# EasyEDA schematic LM471-2-feb-15.json
TITLE: Sheet_1; REV: 1.0; Date: 2024-01-02; Sheet: 1/1; Company: Your Company
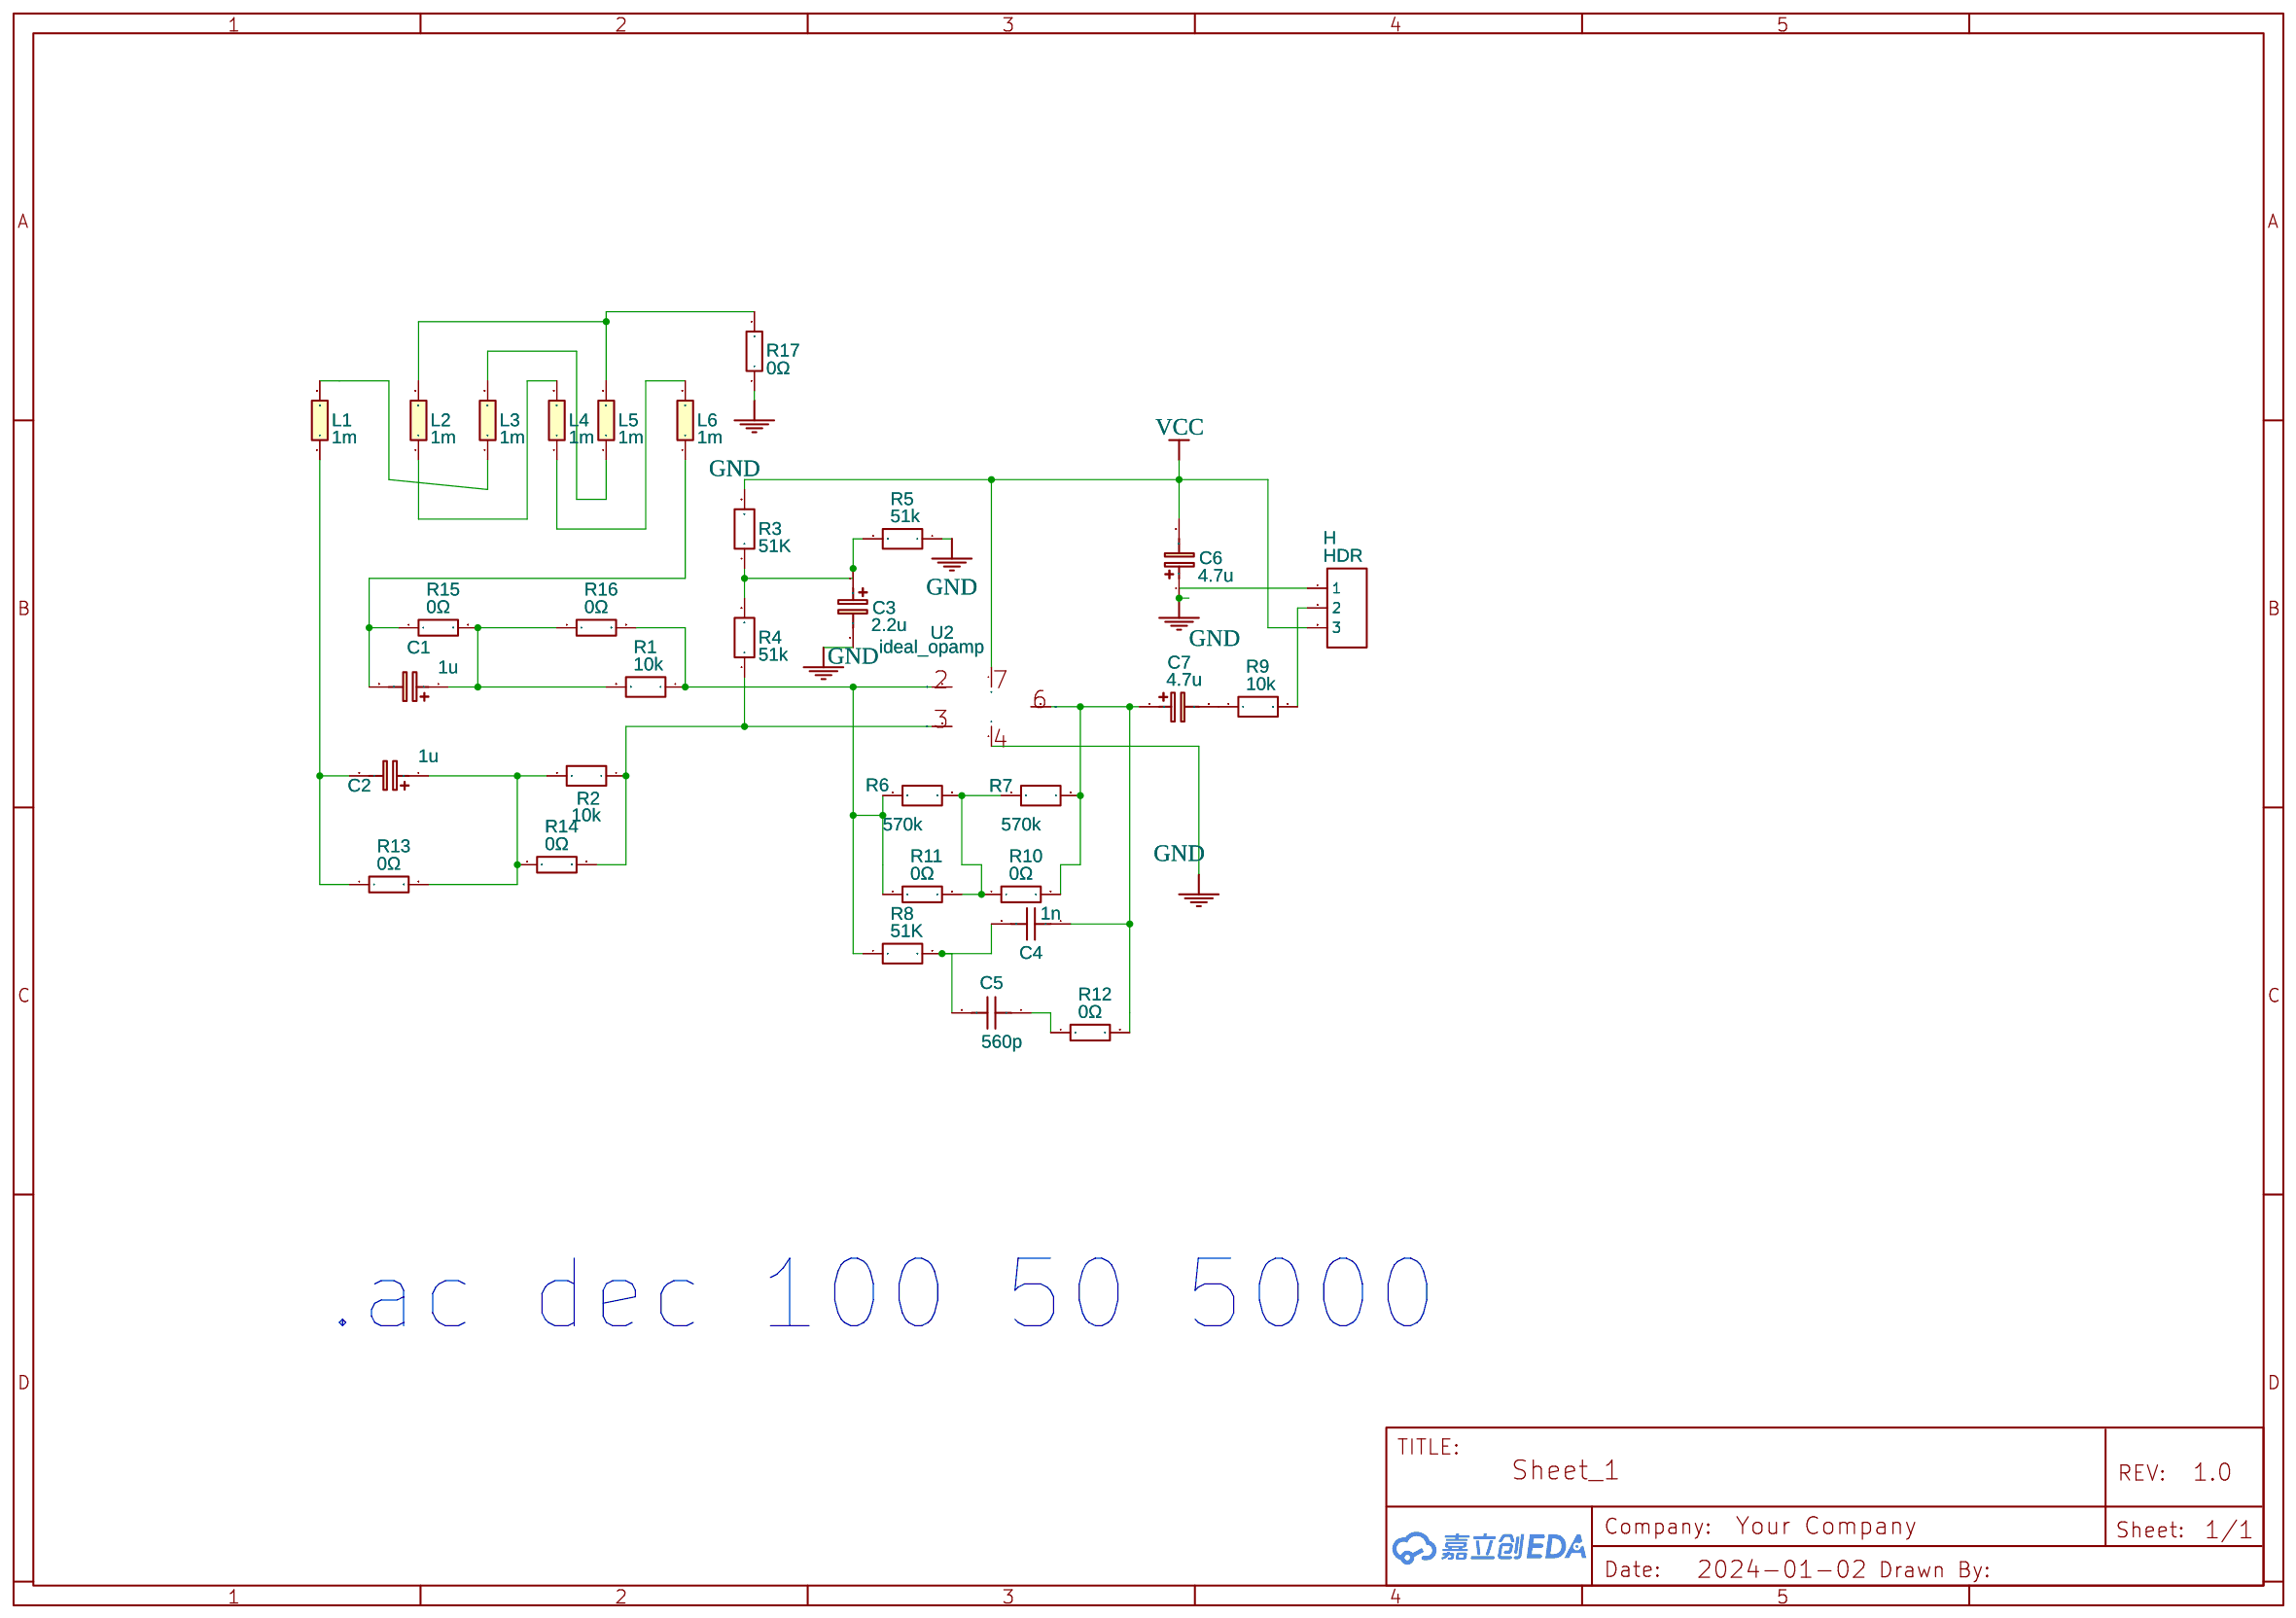
[diagram p0: schematic sheet]

## Parts
C1  1u  [CAPACITOR_SMD0805_HANDSOLDERING_REVA_DATE21JUN2010]
C2  1u  [CAPACITOR_SMD0805_HANDSOLDERING_REVA_DATE21JUN2010]
C3  2.2u  [CAPACITOR_SMD0805_HANDSOLDERING_REVA_DATE21JUN2010]
C4  1n  [CAPACITOR_SMD0805_HANDSOLDERING_REVA_DATE21JUN2010]
C5  560p  [CAPACITOR_SMD0805_HANDSOLDERING_REVA_DATE21JUN2010]
C6  4.7u  [CAPACITOR_SMD0805_HANDSOLDERING_REVA_DATE21JUN2010]
C7  4.7u  [CAPACITOR_SMD0805_HANDSOLDERING_REVA_DATE21JUN2010]
H  HDR  [HDR-F-2.54_1X3]
L1  1m  [L_COILCRAFT_XAL5030]
L2  1m  [L_COILCRAFT_XAL5030]
L3  1m  [L_COILCRAFT_XAL5030]
L4  1m  [L_COILCRAFT_XAL5030]
L5  1m  [L_COILCRAFT_XAL5030]
L6  1m  [L_COILCRAFT_XAL5030]
R1  10k  [R0603]
R2  10k  [R0603]
R3  51K  [R0603]
R4  51k  [R0603]
R5  51k  [R0603]
R6  570k  [R0603]
R7  570k  [R0603]
R8  51K  [R0603]
R9  10k  [R0603]
R10  0Ω  [R01005]
R11  0Ω  [R01005]
R12  0Ω  [R01005]
R13  0Ω  [R01005]
R14  0Ω  [R01005]
R15  0Ω  [R01005]
R16  0Ω  [R01005]
R17  0Ω  [R01005]
U2  ideal_opamp  [TL071H]

## Library data of the parts
C1-C3 C6 C7 = C_Tan_SMD_A_EU: Contributor: LCEDA_Lib
C4 C5 = Capacitor_US: Contributor: EasyEDA; Supplier: YUJING; Capacitance: 1u
H = HDR-F-2.54_1x3: Supplier Part: C146690; Supplier: LCSC; Contributor: LCEDA_Lib
L1-L6 = L0603_EU: Contributor: LCEDA_Lib
R1-R9 = R_0603_EU: Contributor: LCEDA_Lib
R10-R17 = RC0100JR-070RL: Contributor: LCSC; Supplier: LCSC; Supplier Part: C364372; Manufacturer: YAGEO(国巨)
U2 = LM741: Contributor: juan_g2; sim: true

## Nets
GND: C3.2 C6.1 H.1 R5.1 R17.1 U2.4(V-)
VCC: C6.2 H.3 R3.2 U2.7(V+)
Net-(C1-1): C1.1 R1.2 R15.2 R16.1
Net-(C1-2): C1.2 L6.1 R15.1
Net-(C2-1): C2.1 R2.2 R13.2 R14.1
Net-(C2-2): C2.2 L1.1 R13.1
Net-(C3-1): C3.1 R3.1 R4.2 R5.2
Net-(C4-1): C4.1 C7.1 R7.2 R10.2 R12.2 U2.6(OUT)
Net-(C4-2): C4.2 C5.2 R8.2
Net-(C5-1): C5.1 R12.1
Net-(C7-2): C7.2 R9.1
Net-(H-2): H.2 R9.2
Net-(L1-2): L1.2 L3.1
Net-(L2-1): L2.1 L4.2
Net-(L2-2): L2.2 L5.2 R17.2
Net-(L3-2): L3.2 L5.1
Net-(L4-1): L4.1 L6.2
Net-(R1-1): R1.1 R6.1 R8.1 R11.1 R16.2 U2.2(IN-)
Net-(R2-1): R2.1 R4.1 R14.2 U2.3(IN+)
Net-(R6-2): R6.2 R7.1 R10.1 R11.2

## Notes on the sheet
- .ac dec 100 50 5000
